# Altium schematic sheet esp.schdoc
size 209 x 297 mm; PageSetup: Record=PageOptions|CenterHorizontal=False|CenterVertical=False|PrintScale=0.95|XCorrection=0.00|YCorrection=0.00|PrintKind=1|BorderSize=5000000|LeftOffset=0|BottomOffset=0|Orientation=1|PaperLength=1000|PaperWidth=1000|Scale=100|PaperSource=15|PrintQuality=600|MediaType=1|DitherType=10|PaperKind=A4|PrintScaleMode=1
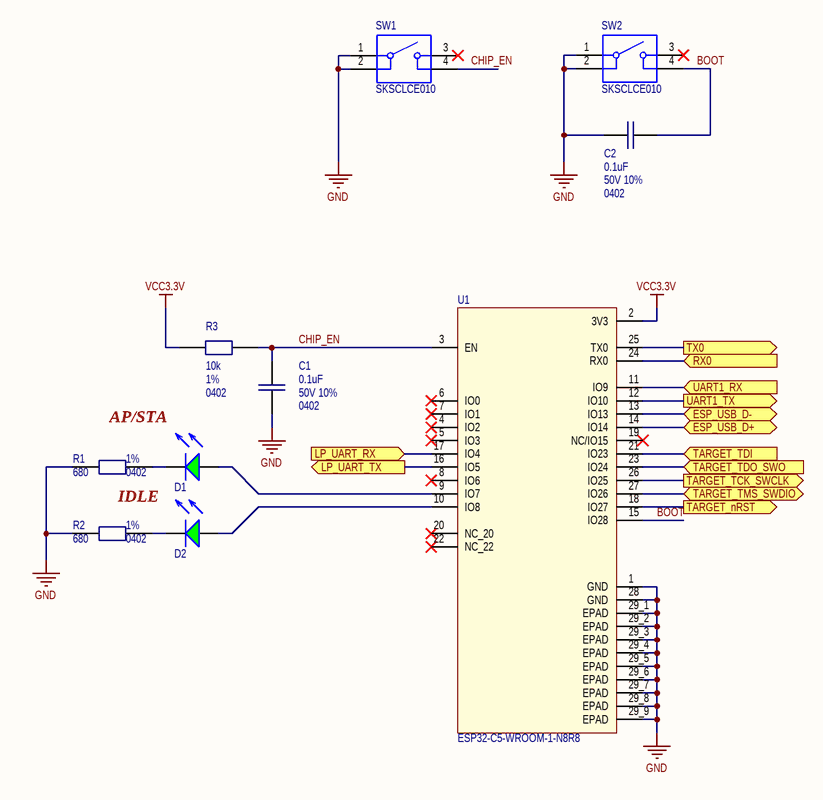
[diagram p0: esp.schdoc]

## Parts
C1  value 0.1uF  Case/Package: 0402  Tolerance: 50V 10%  [C_0402]  (hidden comment: C0402)
C2  value 0.1uF  Case/Package: 0402  Tolerance: 50V 10%  [C_0402]  (hidden comment: C0402)
D1  Emerald Green 515nm  [LED 0603 GREEN, 60°]  (value not drawn)
D2  Emerald Green 515nm  [LED 0603 GREEN, 60°]  (value not drawn)
R1  value 680  Case/Package: 0402  Tolerance: 1%  [R_0402]  (hidden comment: R0402)
R2  value 680  Case/Package: 0402  Tolerance: 1%  [R_0402]  (hidden comment: R0402)
R3  value 10k  Case/Package: 0402  Tolerance: 1%  [R_0402]  (hidden comment: R0402)
SW1  SKSCLCE010  [SKSCLCE010-Footprint-1]
SW2  SKSCLCE010  [SKSCLCE010-Footprint-1]
U1  ESP32-C5-WROOM-1-N8R8  [XCVR_ESP32-C5-WROOM-1-N8R8]

## Ports
ESP_USB_D+ (bidir), ESP_USB_D- (bidir), LP_UART_RX (in), LP_UART_TX (out), RX0 (in), TARGET_nRST (out), TARGET_TCK_SWCLK (out), TARGET_TDI (in), TARGET_TDO_SWO (in), TARGET_TMS_SWDIO (bidir), TX0 (out), UART1_RX (in), UART1_TX (out)

## Nets
GND: C1.1 C2.2 R1.1 R2.1 SW1.1 SW1.2 SW2.1 SW2.2 U1.1(GND) U1.28(GND) U1.29_1(EPAD) U1.29_2(EPAD) U1.29_3(EPAD) U1.29_4(EPAD) U1.29_5(EPAD) U1.29_6(EPAD) U1.29_7(EPAD) U1.29_8(EPAD) U1.29_9(EPAD)
VCC3.3V: R3.1 U1.2(3V3)
BOOT: C2.1 SW2.4 U1.15(IO28)
CHIP_EN: C1.2 R3.2 SW1.4 U1.3(EN)
ESP_USB_D+: U1.14(IO14) ; port ESP_USB_D+
ESP_USB_D-: U1.13(IO13) ; port ESP_USB_D-
LP_UART_RX: U1.17(IO4) ; port LP_UART_RX
LP_UART_TX: U1.16(IO5) ; port LP_UART_TX
RX0: U1.24(RX0) ; port RX0
TARGET_nRST: U1.18(IO27) ; port TARGET_nRST
TARGET_TCK_SWCLK: U1.26(IO25) ; port TARGET_TCK_SWCLK
TARGET_TDI: U1.21(IO23) ; port TARGET_TDI
TARGET_TDO_SWO: U1.23(IO24) ; port TARGET_TDO_SWO
TARGET_TMS_SWDIO: U1.27(IO26) ; port TARGET_TMS_SWDIO
TX0: U1.25(TX0) ; port TX0
UART1_RX: U1.11(IO9) ; port UART1_RX
UART1_TX: U1.12(IO10) ; port UART1_TX
NetD1_1: D1.1 R1.2
NetD1_2: D1.2 U1.9(IO7)
NetD2_1: D2.1 R2.2
NetD2_2: D2.2 U1.10(IO8)

Not connected (* = marked no-connect by the designer): SW1 3*; SW2 3*; U1 4(IO2)* 5(IO3)* 6(IO0)* 7(IO1)* 8(IO6)* 19(NC/IO15)* 20(NC_20)* 22(NC_22)*

## Notes on the sheet
- AP/STA
- IDLE

## Library data of the parts
C1 C2 = C0402: Capacitor; Part: CC0402KRX5R9BB104; Alternative Part: *
D1 D2 = GREEN LED 0603: GREEN LED 0603, 60°; Part: APTD1608ZGC; Alternative Part: *; Color: Emerald Green 515nm
R1 R2 = R0402: Resistor; Part: RC0402FR-07680RL; Alternative Part: *
R3 = R0402: Resistor; Part: RC0402FR-0710KL; Alternative Part: *
SW1 SW2 = SKSCLCE010: 2.9mm 1.25mm Rectangle button 50mA Surface Mount 3.5mm SPST 12V SMD Tactile Switches ROHS; Manufacturer: Alps Alpine; Verified by ME: YES; Voltage Rating: 12V; Alternative Part: *; Part: SKSCLCE010; Manufacturer_PN: SKSCLCE010; Pins: 4; Current Rating: 50mA; Case/Package: SKSCLCE010
U1 = ESP32-C5-WROOM-1-N8R8: 802.15.4, Bluetooth, WiFi 802.11b/g/n/ac/ax, Bluetooth v5.0, Thread, ZigbeeÂ® Transceiver Module 2.412GHz ~ 2.484GHz, 5.18GHz ~ 5.885GHz Antenna Not Included Surface Mount; MF: Espressif Systems; MP: ESP32-C5-WROOM-1U-N8R8; SnapEDA_Link: https://www.snapeda.com/parts/ESP32-C5-WROOM-1U-N8R8/Espressif+Systems/view-part/?ref=snap; Package: None; Value: *; Check_prices: https://www.snapeda.com/parts/ESP32-C5-WROOM-1U-N8R8/Espressif+Systems/view-part/?ref=eda; Part: ESP32-C5-WROOM-1-N8R8